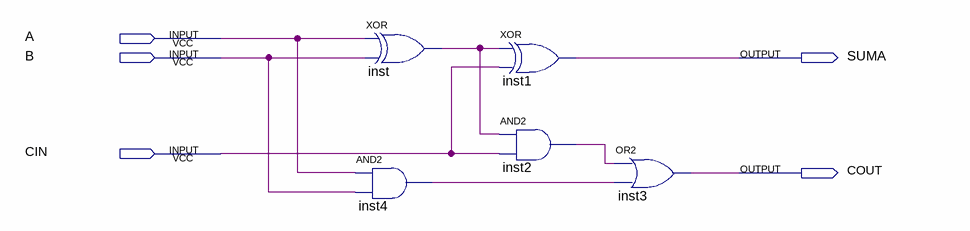
[diagram p0: schematic sheet]
// Quartus schematic SUMA1BIT.bdf as structural Verilog: 5 symbols, 5 pins
module SUMA1BIT (
  input  A,
  input  B,
  input  CIN,
  output SUMA,
  output COUT
);

  wire inst2_out, inst4_out, inst_out;

  and inst4 (inst4_out, A, B);
  xor inst (inst_out, A, B);
  xor inst1 (SUMA, inst_out, CIN);
  and inst2 (inst2_out, inst_out, CIN);
  or inst3 (COUT, inst2_out, inst4_out);
endmodule
